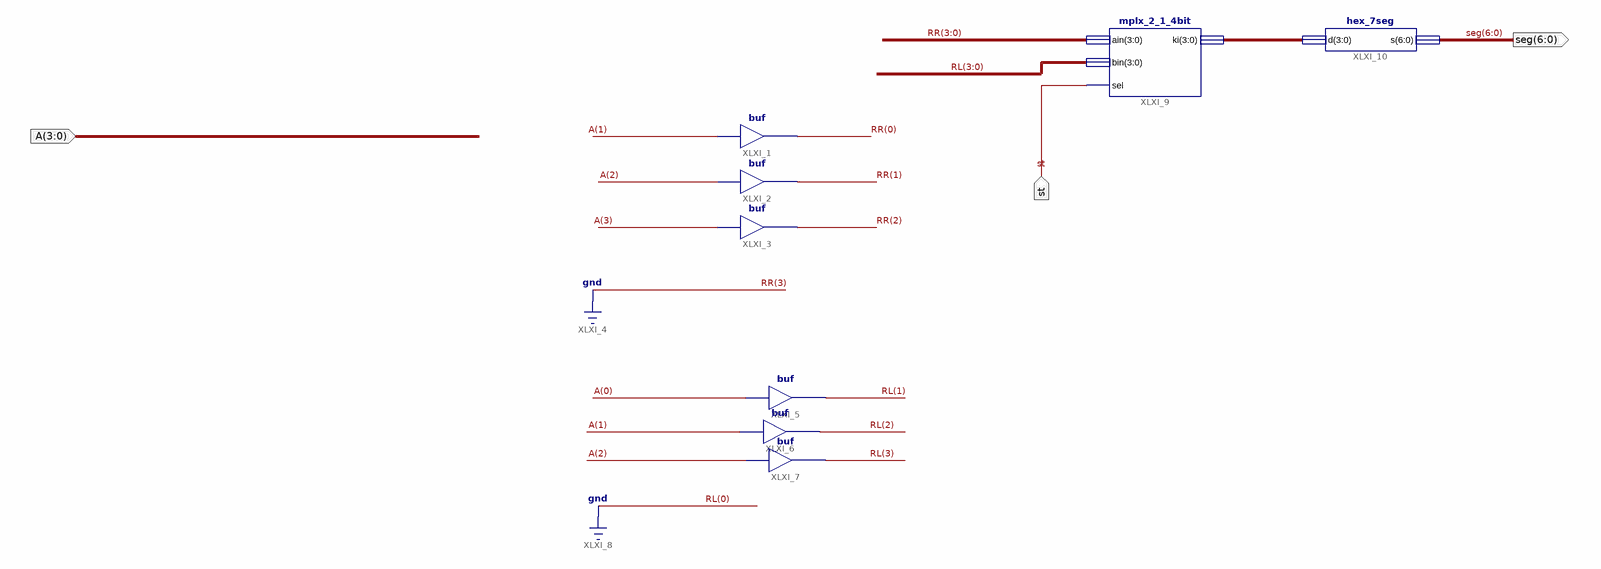
[diagram p0: schematic sheet 1]
// Xilinx ISE schematic alu2_remake.sch (spartan3e) as structural Verilog: 8 symbols, 3 ports
module alu2_remake (
  input  [3:0] A,
  input  st,
  output [6:0] seg
);

  wire [2:0] RR;
  wire [3:0] XLXN_24;
  wire [3:1] RL;

  buf XLXI_1 (RR[0], A[1]);
  buf XLXI_2 (RR[1], A[2]);
  buf XLXI_3 (RR[2], A[3]);
  buf XLXI_5 (RL[1], A[0]);
  buf XLXI_6 (RL[2], A[1]);
  buf XLXI_7 (RL[3], A[2]);
  mplx_2_1_4bit XLXI_9 (.ain({1'b0, RR}), .bin({RL, 1'b0}), .sel(st), .ki(XLXN_24));
  hex_7seg XLXI_10 (.d(XLXN_24), .s(seg));
endmodule
